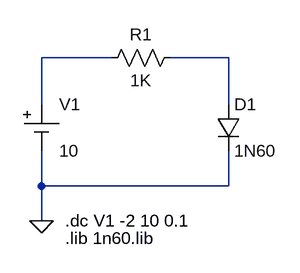
[diagram p0: schematic simulacionDiodo1N60.asc]
simulacionDiodo1N60.asc, the LTspice schematic file:
Version 4.1
SHEET 1 1644 680
WIRE 304 80 208 80
WIRE 464 80 384 80
WIRE 208 144 208 80
WIRE 464 144 464 80
WIRE 208 256 208 208
WIRE 464 256 464 208
WIRE 464 256 208 256
WIRE 208 304 208 256
FLAG 208 304 0
SYMBOL Misc\\cell 208 144 R0
WINDOW 123 0 0 Left 0
WINDOW 39 0 0 Left 0
SYMATTR InstName V1
SYMATTR Value 10
SYMBOL res 400 64 R90
WINDOW 0 0 56 VBottom 2
WINDOW 3 32 56 VTop 2
SYMATTR InstName R1
SYMATTR Value 1K
SYMBOL diode 448 144 R0
SYMATTR InstName D1
SYMATTR Value 1N60
TEXT 240 304 Left 2 !.dc V1 -2 10 0.1
TEXT 240 328 Left 2 !.lib 1n60.lib

The netlist it stands for:
* simulacionDiodo1N60.asc
V1 N001 0 10
R1 N002 N001 1K
D1 N002 0 1N60
.model D D
.lib standard.dio
.dc V1 -2 10 0.1
.lib 1n60.lib
.backanno
.end